# EAGLE design ESP_Breakout (EAGLE 7.7.0)
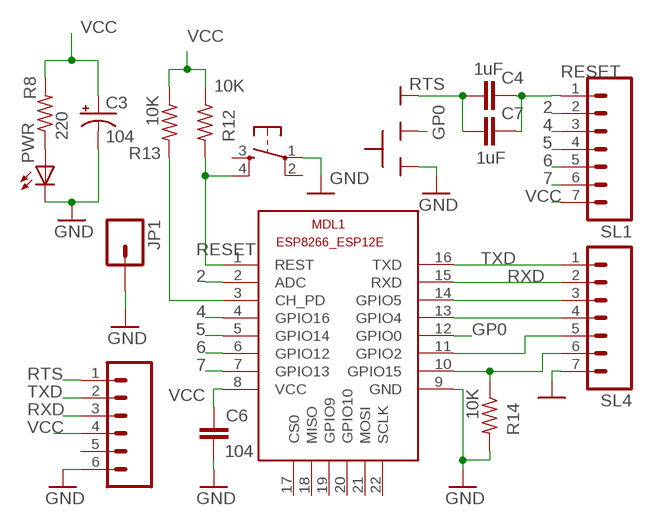
[diagram p0: schematic, sheet 1]

## Parts
C3  104  CAP_POL_10V  [C/6032-28R]
C4  1uF  C-EUC1206  [C1206]
C6  104  C-EUC1206  [C1206]
C7  1uF  C-EUC1206  [C1206]
JP1  M01NOSILK-KIT  [1X01NS-KIT]
MDL1  ESP8266-12EESP8266-ESP12E  [ESP8266-ESP12E]
PWR  LEDCHIPLED_1206  [CHIPLED_1206]
R8  220  R-US_R0805  [R0805]
R12  10K  R-US_R0805  [R0805]
R13  10K  R-US_R0805  [R0805]
R14  10K  RESISTOR0603  [R0603]
SL1  M07  [07P]
SL2  M06  [06P]
SL4  M07  [07P]
U$1  SLIDESWITCH-SMALL  [SMALLSWITCH]
U$2  OMRON_SWITCH_10-XX  [B3F-10XX]

## Nets
2: MDL1.2(ADC) SL1.2
4: MDL1.4(GPIO16) SL1.3
5: MDL1.5(GPIO14) SL1.4
6: MDL1.6(GPIO12) SL1.5
7: MDL1.7(GPIO13) SL1.6
BLED: MDL1.10(GPIO15) R14.1 SL4.6
GND [power]: C3.- C6.2 JP1.1 MDL1.9(GND) PWR.C R14.2 SL2.6 SL4.7 U$1.1 U$2.1(P)
GP0: MDL1.12(GPIO0) U$1.2
N$4: MDL1.14(GPIO5) SL4.3
N$6: MDL1.13(GPIO4) SL4.4
N$7: PWR.A R8.1
N$8: MDL1.11(GPIO2) SL4.5
N$19: MDL1.3(CH_PD) R13.2
RESET: C4.2 C7.2 MDL1.1(REST) R12.2 SL1.1 U$2.4(S1)
RTS: C4.1 C7.1 SL2.1 U$1.3
RXD: MDL1.15(RXD) SL2.3 SL4.2
TXD: MDL1.16(TXD) SL2.2 SL4.1
VCC [power]: C3.+ C6.1 MDL1.8(VCC) R8.2 R12.1 R13.1 SL1.7 SL2.4
Unconnected: MDL1.17(CS0) MDL1.18(MISO) MDL1.19(GPIO9) MDL1.20(GPIO10) MDL1.21(MOSI) MDL1.22(SCLK) SL2.5 U$2.2(P1) U$2.3(S)

## Library data of the parts
C3 = CEDTv78:CAP_POL
C4 C6 C7 = rcl:C-EU: CAPACITOR, European symbol
JP1 = SparkFun-Connectors:M01: Header 1 Standard 1-pin 0.1" header. Use with straight break away headers (SKU : PRT-00116), right angle break away headers (PRT-00553), swiss pins (PRT-00743), machine pins (PRT-00117), and female headers (PRT-00115). SMTSO-256-ET is a "flush mount" nut for a 4-40 screw. The older package used to be too tight, and did not allow it to sit properly thru the drill hit. The latest (0.165DIA) fits nice and snug.
MDL1 = ESP8266-ESP12E:ESP8266-12E: ESP8266-12E with additional I/O and GPIO04/05 corrected The author cannot warrant that this library is free from error or will meet your specific requirements. Created by PuceBaboon.com. Komagane, Nagano, JAPAN
PWR = led:LED: LED OSRAM: - CHIPLED LG R971, LG N971, LY N971, LG Q971, LY Q971, LO R971, LY R971 LH N974, LH R974 LS Q976, LO Q976, LY Q976 LO Q996 - Hyper CHIPLED LW Q18S LB Q993, LB Q99A, LB R99A - SideLED LS A670, LO A670, LY A670, LG A670, LP A670 LB A673, LV A673, LT A673, LW A673 LH A674 LY A675 LS A676, LA A676, LO A676, LY A676, LW A676 LS A679, LY A679, LG A679 - Hyper Micro SIDELED® LS Y876, LA Y876, LO Y876, LY Y876 LT Y87S - SmartLED LW L88C, LW L88S LB L89C, LB L89S, LG L890 LS L89K, LO L89K, LY L89K LS L896, LA L896, LO L896, LY L896 - TOPLED LS T670, LO T670, LY T670, LG T670, LP T670 LSG T670, LSP T670, LSY T670, LOP T670, LYG T670 LG T671, LOG T671, LSG T671 LB T673, LV T673, LT T673, LW T673 LH T674 LS T676, LA T676, LO T676, LY T676, LB T676, LH T676, LSB T676, LW T676 LB T67C, LV T67C, LT T67C, LS T67K, LO T67K, LY T67K, LW E67C LS E67B, LA E67B, LO E67B, LY E67B, LB E67C, LV E67C, LT E67C LW T67C LS T679, LY T679, LG T679 LS T770, LO T770, LY T770, LG T770, LP T770 LB T773, LV T773, LT T773, LW T773 LH T774 LS E675, LA E675, LY E675, LS T675 LS T776, LA T776, LO T776, LY T776, LB T776 LHGB T686 LT T68C, LB T68C - Hyper Mini TOPLED® LB M676 - Mini TOPLED Santana® LG M470 LS M47K, LO M47K, LY M47K Source: http://www.osram.convergy.de LUXEON: - LUMILED® LXK2-PW12-R00, LXK2-PW12-S00, LXK2-PW14-U00, LXK2-PW14-V00 LXK2-PM12-R00, LXK2-PM12-S00, LXK2-PM14-U00 LXK2-PE12-Q00, LXK2-PE12-R00, LXK2-PE12-S00, LXK2-PE14-T00, LXK2-PE14-U00 LXK2-PB12-K00, LXK2-PB12-L00, LXK2-PB12-M00, LXK2-PB14-N00, LXK2-PB14-P00, LXK2-PB14-Q00 LXK2-PR12-L00, LXK2-PR12-M00, LXK2-PR14-Q00, LXK2-PR14-R00 LXK2-PD12-Q00, LXK2-PD12-R00, LXK2-PD12-S00 LXK2-PH12-R00, LXK2-PH12-S00 LXK2-PL12-P00, LXK2-PL12-Q00, LXK2-PL12-R00 Source: www.luxeon.com KINGBRIGHT: KA-3528ASYC Source: www.kingbright.com
R8 R12 R13 = resistor:R-US_: RESISTOR, American symbol
R14 = CEDT_JANUARY_2015_v5:RESISTOR
SL1 SL4 = con-amp-quick:M07: AMP QUICK CONNECTOR; OC_FARNELL: unknown; OC_NEWARK: unknown
SL2 = con-amp-quick:M06: AMP QUICK CONNECTOR; OC_FARNELL: unknown; OC_NEWARK: unknown
U$1 = CEDT_JANUARY_2015_v5:SLIDESWITCH
U$2 = CEDT_JANUARY_2015_v5:OMRON_SWITCH

## Net classes
0 default: width 0.508 mm
1 power: width 0.61 mm

## Board
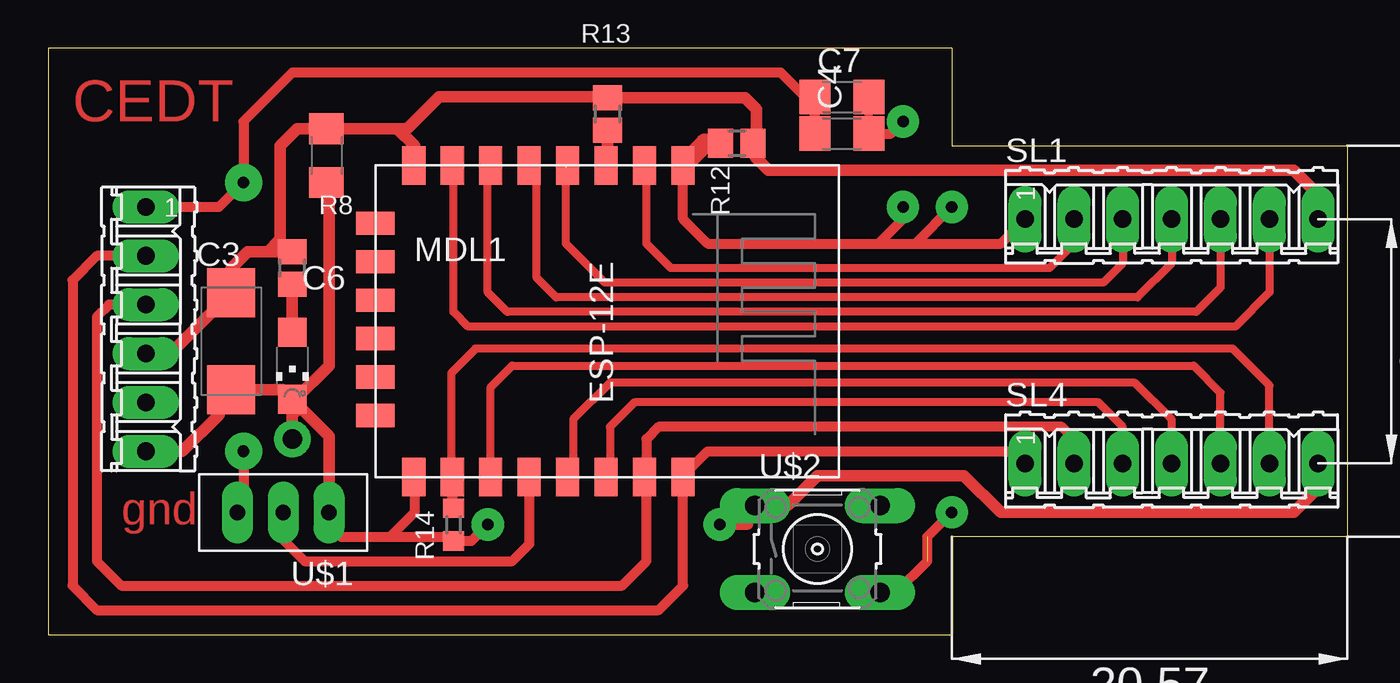
[diagram p1: board, top side]
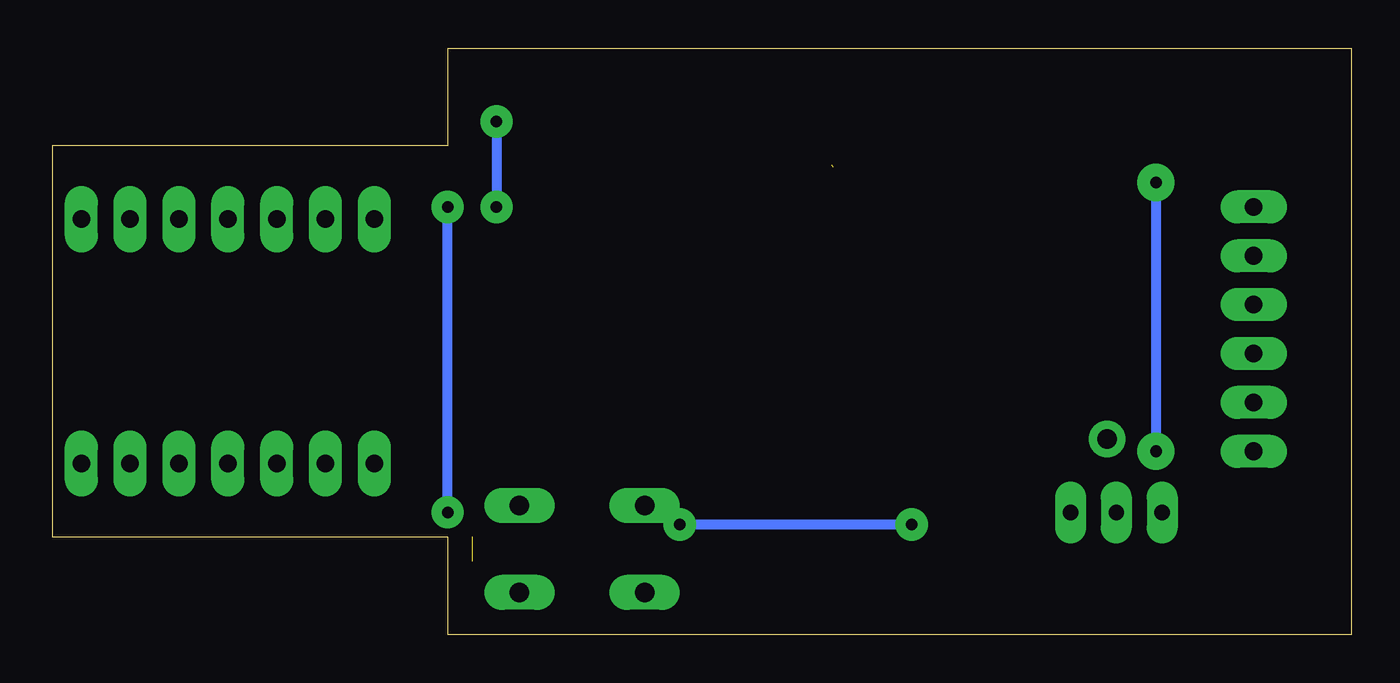
[diagram p2: board, bottom side, seen from below]

Size 67.56 x 30.48 mm. Coordinates in mm from the lower left corner, seen from the top.
Outline: 46.99,30.48 0,30.48 0,0 46.99,0 46.99,5.08 67.56,5.08 67.56,25.4 46.99,25.4 46.99,30.48
Copper layers (1*16): Top 0.035mm / dielectric 1.5mm / Bottom 0.035mm
Design rules "default *": minimum track width 10mil, minimum drill 24mil, track to track 12mil, track to pad 12mil, pad to pad 12mil, via to via 12mil, smd to smd 12mil, copper to edge 40mil, drill to drill 8mil, minimum pad ring 16mil, minimum via ring 16mil, stop-mask expansion 4mil, vias tented up to drill 0mil, thermal gap 10mil

### Footprints (pad centres in the part's own frame; a part is rotated, then mirrored left to right if it is on the bottom)
C/6032-28R = smd 2.55 x 2.5: + 2.525,0; - -2.525,0
C1206 = smd 1.6 x 1.8: 1 -1.4,0; 2 1.4,0
1X01NS-KIT = drill 1.016 pad 1.88: 1 0,0
ESP8266-ESP12E = smd 2 x 1.2: 1 0,16; 2 0,14; 3 0,12; 4 0,10; 5 0,8; 6 0,6; 7 0,4; 8 0,2; 9 16.2,2; 10 16.2,4; 11 16.2,6; 12 16.2,8; 13 16.2,10; 14 16.2,12; 15 16.2,14; 16 16.2,16 | smd 1.2 x 2: 17 11,0; 18 3,0; 19 5,0; 20 13,0; 21 7,0; 22 9,0
CHIPLED_1206 = smd 1.5 x 1.5: A 0,-1.75; C 0,1.75
R0805 = smd 1.3 x 1.5: 1 -0.85,0; 2 0.85,0
R0603 = smd 1 x 1.1: 1 -0.85,0; 2 0.85,0
07P = drill 0.914 long: 1 -7.62,0; 2 -5.08,0; 3 -2.54,0; 4 0,0; 5 2.54,0; 6 5.08,0; 7 7.62,0
06P = drill 0.914 long: 1 -6.35,0; 2 -3.81,0; 3 -1.27,0; 4 1.27,0; 5 3.81,0; 6 6.35,0
SMALLSWITCH = drill 0.8 long: 1 -2.54,0; 2 -0.159,0; 3 2.223,0
B3F-10XX = drill 1.016 long: 1 -3.251,2.261; 2 3.251,2.261; 3 -3.251,-2.261; 4 3.251,-2.261

### Placement (x,y rotation side)
C3  9.53,15.24 90 top
C4  41.27,26.04 0 top
C6  14.48,24.89 270 top
C7  41.27,27.94 0 top
JP1  12.7,10.16 0 top
MDL1  17.02,24.38 270 top
PWR  12.7,13.97 180 top
R8  12.7,19.05 90 top
R12  35.81,25.53 180 top
R13  29.08,27.05 270 top
R14  21.08,5.71 270 top
SL1  58.42,21.59 0 top
SL2  5.08,15.88 270 top
SL4  58.42,8.89 0 top
U$1  12.06,6.35 180 top
U$2  40.01,4.45 0 top

### Tracks (layer width: path | path; a pad name or v marks a point on that pad's centre or on a via)
2
  Top 0.406: SL1.2 53.34,20.32 52.07,19.05 32.38,19.05 31.11,20.32 31.11,24.29 MDL1.2
4  (1 unrouted)
  Top 0.406: SL1.3 55.88,19.3 54.86,18.29 28.96,18.29 26.92,20.32 26.92,24.29
5
  Top 0.406: SL1.4 58.42,19.3 56.64,17.53 26.42,17.53 25.4,18.54 25.4,24 MDL1.5
6
  Top 0.406: SL1.5 60.96,18.03 59.69,16.76 23.88,16.76 22.86,17.78 22.86,24.23 MDL1.6
7
  Top 0.406: SL1.6 63.5,17.78 61.72,16 21.84,16 21.08,16.76 21.08,24.32 MDL1.7
BLED
  Top 0.406: SL4.6 63.5,12.95 61.59,14.86 22.23,14.86 20.95,13.59 20.95,8.25 MDL1.10
  Top 0.508: MDL1.10 21.02,6.63 R14.1
GND  (via drill 0.6 pad 1.68)
  Top 0.508: MDL1.9 19.05,8.15 19.05,6.35 17.78,5.08 | U$1.1 14.61,5.71 15.24,5.08 17.78,5.08 | 17.78,5.08 20.87,5.08 R14.2 22.01,4.87 v22.86,5.71 | v34.92,5.71 36.4,5.71 U$2.1
  Top 0.61: SL2.6 6.99,9.53 8.89,11.43 8.89,12.7 9.51,12.7 C3.- 12.21,12.71 PWR.C | U$1.1 14.61,10.31 13.1,11.82 | 13.1,11.82 PWR.C | PWR.C 12.86,12.22 14.61,13.97 14.61,23.36 C6.2 | JP1.1 12.7,11.43 13.1,11.82 | SL4.7 66.04,7.62 64.77,6.35 49.53,6.35 47.62,8.26 40.01,8.26 38.46,6.71 U$2.1
  Bottom 0.508: v22.86,5.71 v34.92,5.71
GP0
  Top 0.508: U$1.2 12.22,4.92 13.34,3.81 24.13,3.81 25.02,4.7 MDL1.12
N$4
  Top 0.406: SL4.3 55.88,10.79 54.61,12.06 30.48,12.06 29.21,10.79 29.21,8.38 MDL1.14
N$6
  Top 0.406: SL4.4 58.42,11.18 56.52,13.08 29.21,13.08 27.3,11.18 27.3,8.47 MDL1.13
N$7
  Top 0.61: PWR.A R8.1
N$8
  Top 0.406: SL4.5 60.96,12.57 59.56,13.97 24.13,13.97 23.02,12.86 MDL1.11
N$19
  Top 0.61: R13.2 29.08,24.45 MDL1.3
RESET  (via drill 0.6 pad 1.68)  (1 unrouted)
  Top 0.406: C4.2 C7.2
  Top 0.508: MDL1.1 33.02,21.59 34.29,20.32 43.18,20.32 | C4.2 43.81,26.04 v44.45,26.67 | 43.18,20.32 45.09,20.32 | 45.09,20.32 49.53,20.32 SL1.1 | v44.45,22.23 44.45,21.59 43.18,20.32 | v46.99,22.23 45.09,20.32 | v46.99,6.35 45.72,5.08 45.72,3.81 44.09,2.18 U$2.4
  Top 1.016: R12.2 34.16,25.53 MDL1.1
  Bottom 0.508: v44.45,26.67 v44.45,22.23 | v46.99,6.35 v46.99,22.23
RTS  (via drill 0.6 pad 1.93)
  Top 0.406: C7.1 39.88,27.43
  Top 0.508: C4.1 39.88,27.43 38.1,29.21 12.7,29.21 10.16,26.67 v10.16,23.5 8.89,22.23 SL2.1 | v10.16,9.53 10.16,6.67 U$1.3
  Bottom 0.508: v10.16,23.5 v10.16,9.53
RXD
  Top 0.508: SL2.3 3.17,17.14 2.54,16.51 2.54,3.81 3.81,2.54 29.84,2.54 31.11,3.81 31.11,8.09 | SL4.2 53.34,10.16 52.7,10.79 31.75,10.79 31.11,10.16 31.11,8.28 MDL1.15
  Top 0.61: 31.11,8.09 MDL1.15
TXD
  Top 0.508: SL2.2 2.54,19.68 1.27,18.41 1.27,2.54 2.54,1.27 31.75,1.27 33.02,2.54 MDL1.16 | MDL1.16 33.02,8.25 34.29,9.53 50.16,9.53 SL4.1
  Top 0.61: MDL1.16
VCC
  Top 0.61: SL1.7 66.04,22.86 64.77,24.13 37.47,24.13 36.79,24.8 36.79,25.4 R12.1 36.83,25.69 36.83,27.3 36.23,27.9 R13.1 29.04,27.94 20.32,27.94 18.67,26.29 18.16,26.29 | SL2.4 6.35,14.61 8.89,17.14 8.9,17.14 C3.+ 9.53,19.05 10.38,19.9 11.43,19.9 | R8.2 11.43,19.9 | 11.43,19.9 12.06,20.54 12.06,25.4 12.96,26.29 C6.1 18.16,26.29 | MDL1.8 19.05,24.42 19.05,25.4 18.16,26.29

### Text on the board
Top: CEDT | gnd